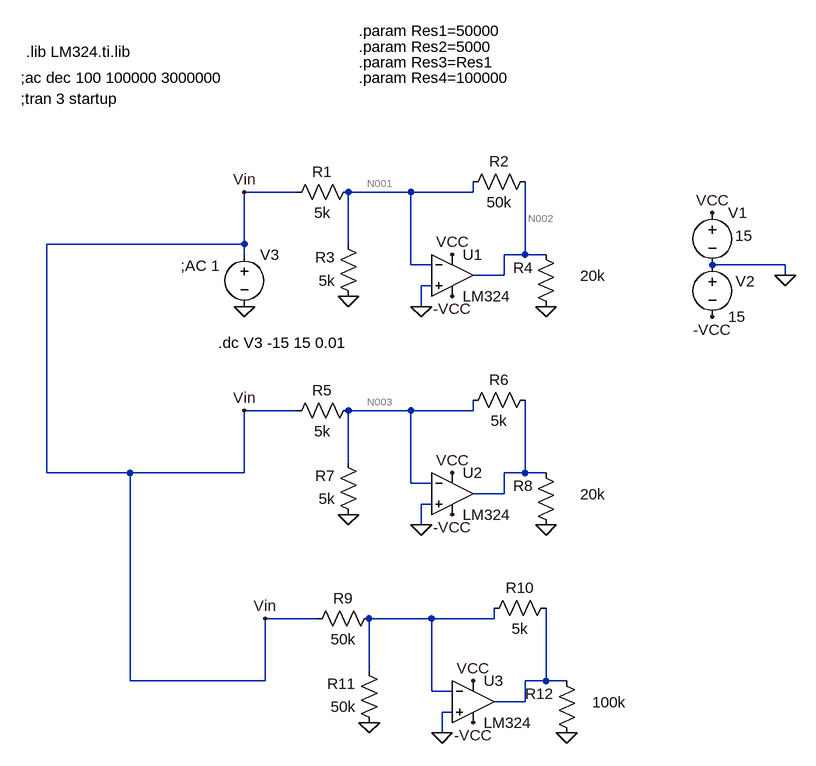
[diagram p0: schematic 3_dc_sweep.asc]
3_dc_sweep.asc, the LTspice schematic file:
Version 4
SHEET 1 880 920
WIRE -128 0 -208 0
WIRE 48 0 -48 0
WIRE 144 0 144 -16
WIRE 144 0 48 0
WIRE -208 80 -208 0
WIRE -208 80 -512 80
WIRE -48 80 -48 0
WIRE -208 96 -208 80
WIRE 224 96 224 -16
WIRE 224 96 192 96
WIRE 256 96 224 96
WIRE 48 112 48 0
WIRE 80 112 48 112
WIRE 624 112 512 112
WIRE 192 128 192 96
WIRE 192 128 144 128
WIRE 624 128 624 112
WIRE 80 144 64 144
WIRE 64 176 64 144
WIRE -128 336 -208 336
WIRE 48 336 -48 336
WIRE 144 336 144 320
WIRE 144 336 48 336
WIRE -48 416 -48 336
WIRE -512 432 -512 80
WIRE -384 432 -512 432
WIRE -208 432 -208 336
WIRE -208 432 -384 432
WIRE 224 432 224 320
WIRE 224 432 192 432
WIRE 256 432 224 432
WIRE 48 448 48 336
WIRE 80 448 48 448
WIRE 192 464 192 432
WIRE 192 464 144 464
WIRE 80 480 64 480
WIRE 64 512 64 480
WIRE -96 656 -176 656
WIRE 80 656 -16 656
WIRE 176 656 176 640
WIRE 176 656 80 656
WIRE -16 736 -16 656
WIRE -384 752 -384 432
WIRE -176 752 -176 656
WIRE -176 752 -384 752
WIRE 256 752 256 640
WIRE 256 752 224 752
WIRE 288 752 256 752
WIRE 80 768 80 656
WIRE 112 768 80 768
WIRE 224 784 224 752
WIRE 224 784 176 784
WIRE 112 800 96 800
WIRE 96 832 96 800
FLAG 624 128 0
FLAG 512 32 VCC
FLAG 112 96 VCC
FLAG 112 160 -VCC
FLAG -208 176 0
FLAG -48 160 0
FLAG 64 176 0
FLAG 256 176 0
FLAG -208 0 Vin
FLAG 112 432 VCC
FLAG 112 496 -VCC
FLAG -48 496 0
FLAG 64 512 0
FLAG 256 512 0
FLAG -208 336 Vin
FLAG 144 752 VCC
FLAG 144 816 -VCC
FLAG -16 816 0
FLAG 96 832 0
FLAG 288 832 0
FLAG -176 656 Vin
FLAG 512 192 -VCC
SYMBOL Opamps\\opamp2 112 64 R0
SYMATTR InstName U1
SYMATTR Value LM324
SYMBOL voltage 512 16 R0
WINDOW 3 35 51 Left 2
WINDOW 123 0 0 Left 2
WINDOW 39 0 0 Left 2
SYMATTR Value 15
SYMATTR InstName V1
SYMBOL voltage 512 96 R0
WINDOW 0 36 41 Left 2
WINDOW 123 0 0 Left 2
WINDOW 39 0 0 Left 2
SYMATTR InstName V2
SYMATTR Value 15
SYMBOL voltage -208 80 R0
WINDOW 123 -98 33 Left 2
WINDOW 39 0 0 Left 2
SYMATTR Value2 ;AC 1
SYMATTR Value ""
SYMATTR InstName V3
SYMBOL res -32 -16 R90
WINDOW 0 0 56 VBottom 2
WINDOW 3 32 56 VTop 2
SYMATTR InstName R1
SYMATTR Value 5k
SYMBOL res 240 -32 R90
WINDOW 0 0 56 VBottom 2
WINDOW 3 32 56 VTop 2
SYMATTR InstName R2
SYMATTR Value 50k
SYMBOL res -32 176 R180
WINDOW 0 36 76 Left 2
WINDOW 3 36 40 Left 2
SYMATTR InstName R3
SYMATTR Value 5k
SYMBOL res 272 192 R180
WINDOW 0 36 76 Left 2
WINDOW 3 -76 63 Left 2
SYMATTR InstName R4
SYMATTR Value 20k
SYMBOL Opamps\\opamp2 112 400 R0
SYMATTR InstName U2
SYMATTR Value LM324
SYMBOL res -32 320 R90
WINDOW 0 0 56 VBottom 2
WINDOW 3 32 56 VTop 2
SYMATTR InstName R5
SYMATTR Value 5k
SYMBOL res 240 304 R90
WINDOW 0 0 56 VBottom 2
WINDOW 3 32 56 VTop 2
SYMATTR InstName R6
SYMATTR Value 5k
SYMBOL res -32 512 R180
WINDOW 0 36 76 Left 2
WINDOW 3 36 40 Left 2
SYMATTR InstName R7
SYMATTR Value 5k
SYMBOL res 272 528 R180
WINDOW 0 36 76 Left 2
WINDOW 3 -76 63 Left 2
SYMATTR InstName R8
SYMATTR Value 20k
SYMBOL Opamps\\opamp2 144 720 R0
SYMATTR InstName U3
SYMATTR Value LM324
SYMBOL res 0 640 R90
WINDOW 0 0 56 VBottom 2
WINDOW 3 32 56 VTop 2
SYMATTR InstName R9
SYMATTR Value 50k
SYMBOL res 272 624 R90
WINDOW 0 0 56 VBottom 2
WINDOW 3 32 56 VTop 2
SYMATTR InstName R10
SYMATTR Value 5k
SYMBOL res 0 832 R180
WINDOW 0 36 76 Left 2
WINDOW 3 36 40 Left 2
SYMATTR InstName R11
SYMATTR Value 50k
SYMBOL res 304 848 R180
WINDOW 0 36 76 Left 2
WINDOW 3 -76 63 Left 2
SYMATTR InstName R12
SYMATTR Value 100k
TEXT -552 -144 Left 2 !;tran 3 startup
TEXT -544 -216 Left 2 !.lib LM324.ti.lib
TEXT -552 -176 Left 2 !;ac dec 100 100000 3000000
TEXT -32 -248 Left 2 !.param Res1=50000
TEXT -32 -224 Left 2 !.param Res2=5000
TEXT -32 -200 Left 2 !.param Res3=Res1
TEXT -32 -176 Left 2 !.param Res4=100000
TEXT -248 232 Left 2 !.dc V3 -15 15 0.01

The netlist it stands for:
* 3_dc_sweep.asc
XU1 0 N001 VCC -VCC N002 LM324  ; pins In+ In- V+ V- OUT
V1 VCC 0 15
V2 0 -VCC 15
V3 Vin 0 ;AC 1
R1 N001 Vin 5k
R2 N002 N001 50k
R3 0 N001 5k
R4 0 N002 20k
XU2 0 N003 VCC -VCC N004 LM324  ; pins In+ In- V+ V- OUT
R5 N003 Vin 5k
R6 N004 N003 5k
R7 0 N003 5k
R8 0 N004 20k
XU3 0 N005 VCC -VCC N006 LM324  ; pins In+ In- V+ V- OUT
R9 N005 Vin 50k
R10 N006 N005 5k
R11 0 N005 50k
R12 0 N006 100k
;tran 3 startup
.lib LM324.ti.lib
;ac dec 100 100000 3000000
.param Res1=50000
.param Res2=5000
.param Res3=Res1
.param Res4=100000
.dc V3 -15 15 0.01
.backanno
.end

* Results of the author's LTspice run, read from the files saved beside the schematic
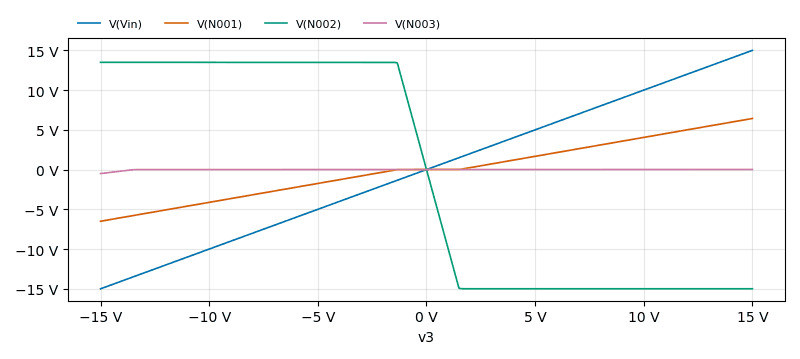
[diagram p1: DC transfer characteristic of 3_dc_sweep.asc, plotted from the saved traces]
* DC transfer characteristic, 1 run:
*   V(Vin): -15 V at v3=-15 V, 15 V at v3=15 V, min -15 V, max 15 V
*   V(N001): -6.5 V at v3=-15 V, 6.429 V at v3=15 V, min -6.5 V, max 6.429 V
*   V(N002): 13.5 V at v3=-15 V, -15 V at v3=15 V, min -15 V, max 13.5 V
*   V(N003): -501.5 mV at v3=-15 V, 15.7 mV at v3=15 V, min -501.5 mV, max 15.7 mV